# EAGLE design wisenode_v1.0 (EAGLE 6.3)
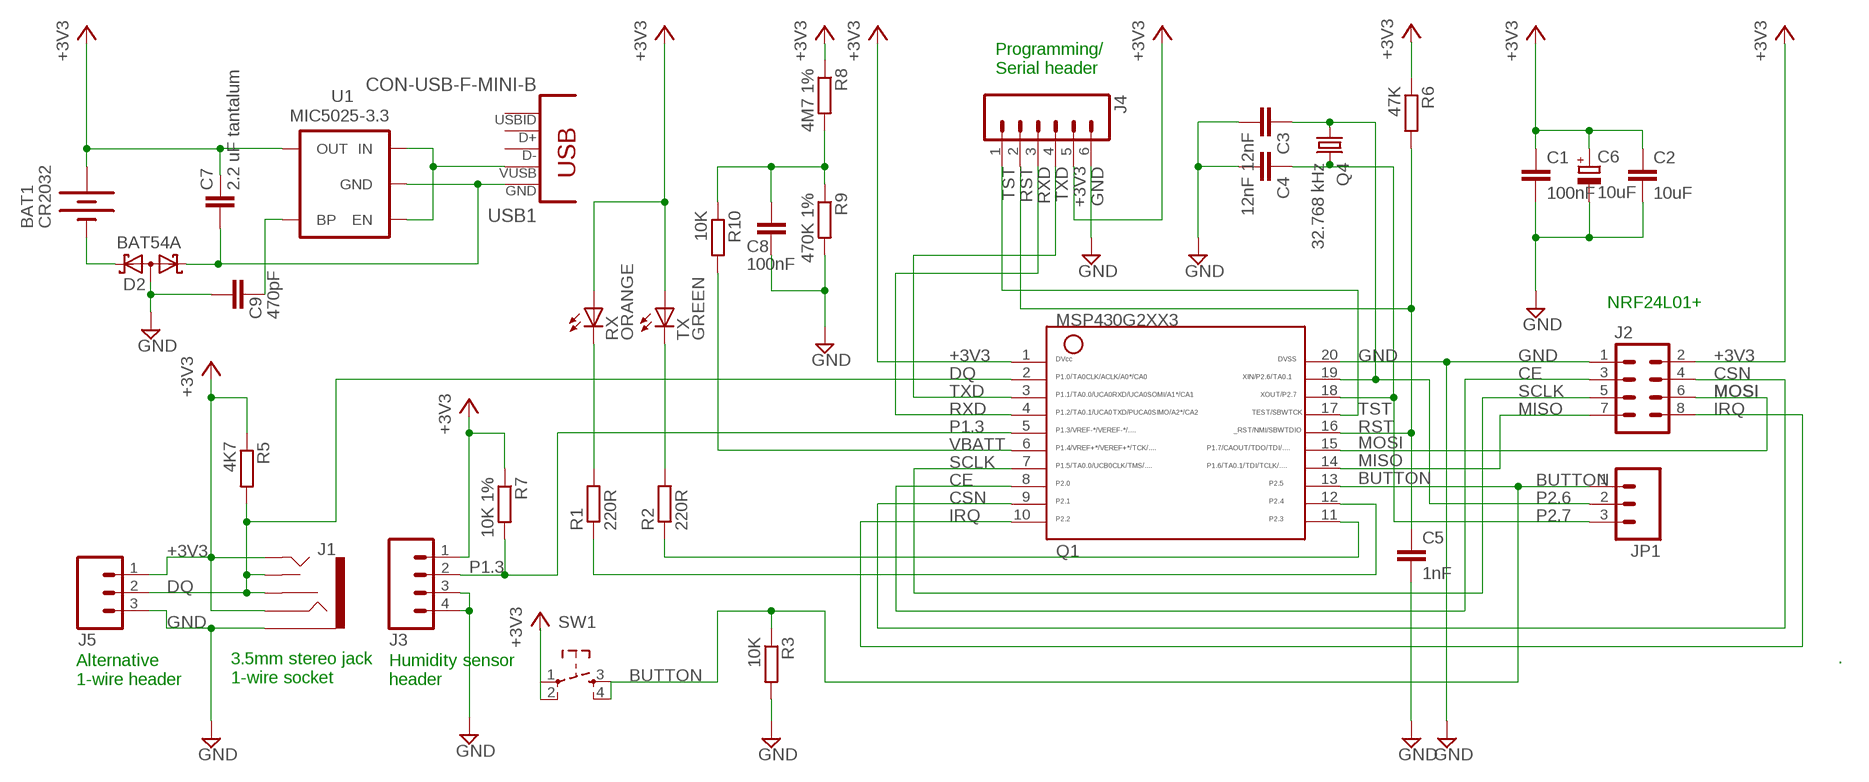
[diagram p0: schematic, sheet 1]

## Parts
BAT1  CR2032  BATTERY20PTH  [BATTCOM_20MM_PTH]
C1  100nF  C-EUC0805  [C0805]
C2  10uF  C-EUC1206  [C1206]
C3  12nF  C-EUC0805  [C0805]
C4  12nF  C-EUC0805  [C0805]
C5  1nF  C-EUC0805  [C0805]
C6  10uF  CPOL-EUE2.5-7  [E2,5-7]
C7  2.2 uF tantalum  C-EUC1206  [C1206]
C8  100nF  C-EUC0805  [C0805]
C9  470pF  C-EUC0805  [C0805]
D2  BAT54A  [SOT23]
J1  AUDIO-JACK2PTH  [AUDIO-JACK]
J2  M04X2  [2X4]
J3  M04PTH  [1X04]
J4  M06SIP  [1X06]
J5  M03PTH  [1X03]
JP1  M03PTH  [1X03]
Q1  G2XX3---PW20  [PW20]
Q4  32.768 kHz  CRYSTALTC38H  [TC38H]
R1  220R  R-EU_M0805  [M0805]
R2  220R  R-EU_M0805  [M0805]
R3  10K  R-EU_M0805  [M0805]
R5  4K7  R-EU_M0805  [M0805]
R6  47K  R-EU_M0805  [M0805]
R7  10K 1%  R-EU_M0805  [M0805]
R8  4M7 1%  R-EU_M0805  [M0805]
R9  470K 1%  R-EU_M0805  [M0805]
R10  10K  R-EU_M0805  [M0805]
RX  ORANGE  LEDCHIPLED_0805  [CHIPLED_0805]
SW1  SW_TACT_4P  [SW_TACT_SMALL]
TX  GREEN  LEDCHIPLED_0805  [CHIPLED_0805]
U1  MIC5025-3.3  V_REG_LDOSMD  [SOT23-5]
USB1  CON-USB-F-MINI-B  [CONN_USB_MINI-B]

## Nets
+3V3: BAT1.1(+) C1.1 C2.1 C6.+ C7.1 J1.RING J1.TIP J2.2 J3.1 J4.5 J5.1 Q1.1 R5.1 R6.1 R7.1 R8.1 RX.A SW1.1 SW1.2 TX.A U1.5(OUT)
BUTTON: JP1.1 Q1.13 R3.1 SW1.3 SW1.4
CE: J2.3 Q1.8
CSN: J2.4 Q1.9
DQ: J1.RSH J1.TSH J5.2 Q1.2 R5.2
GND: C1.2 C2.2 C3.2 C4.2 C5.2 C6.- C8.2 C9.1 D2.3(AA) J1.SLEEVE J2.1 J3.3 J3.4 J4.6 J5.3 Q1.20 R3.2 R9.2
IRQ: J2.8 Q1.10
MISO: J2.7 Q1.14
MOSI: J2.6 Q1.15
N$1: R2.2 TX.C
N$2: R1.2 RX.C
N$3: Q1.11 R2.1
N$5: Q1.12 R1.1
N$11: C7.2 D2.1(K1) U1.2(GND) USB1.GND
N$12: U1.1(IN) U1.3(EN) USB1.VUSB
N$13: BAT1.2(-) D2.2(K2)
N$15: C9.2 U1.4(BP)
P1.3: J3.2 Q1.5 R7.2
P2.6: C3.1 JP1.2 Q1.19 Q4.1
P2.7: C4.1 JP1.3 Q1.18 Q4.2
RST: C5.1 J4.2 Q1.16 R6.2
RXD: J4.3 Q1.4
SCLK: J2.5 Q1.7
TST: J4.1 Q1.17
TXD: J4.4 Q1.3
VBATT: Q1.6 R10.2
VBATT1: C8.1 R8.2 R9.1 R10.1
Unconnected: USB1.BODY@1(BODY) USB1.BODY@2(BODY) USB1.BODY@3(BODY) USB1.BODY@4(BODY) USB1.D+ USB1.D- USB1.ID(USBID)

## Notes on the sheet
- Programming/
  Serial header
- NRF24L01+
- .
- 3.5mm stereo jack
  1-wire socket
- Alternative
  1-wire header
- Humidity sensor 
  header

## Library data of the parts
BAT1 = SparkFun:BATTERY: Battery Holders Various common sizes : AA, AAA, 20mm coin cell and 12mm coin cell.
C1 C3-C5 C8 C9 = resistor:C-EU: CAPACITOR, European symbol
C2 C7 = rcl:C-EU: CAPACITOR, European symbol
C6 = rcl:CPOL-EU: POLARIZED CAPACITOR, European symbol
D2 = diode:BAT54A: Schottky Diodes Source: Fairchild .. BAT54.pdf
J1 = SparkFun-Connectors:AUDIO-JACK2: Stereo audio jack with bypass switches.
J2 = SparkFun:M04X2
J3 = SparkFun:M04: Header 4 Standard 4-pin 0.1" header. Use with straight break away headers (SKU : PRT-00116), right angle break away headers (PRT-00553), swiss pins (PRT-00743), machine pins (PRT-00117), and female headers (PRT-00115). Molex polarized connector foot print use with SKU : PRT-08231 with associated crimp pins and housings. 1MM SMD Version SKU: PRT-10208
J4 = SparkFun:M06: Header 6 Standard 6-pin 0.1" header. Use with straight break away headers (SKU : PRT-00116), right angle break away headers (PRT-00553), swiss pins (PRT-00743), machine pins (PRT-00117), and female headers (PRT-00115). Molex polarized connector foot print use with SKU : PRT-08094 with associated crimp pins and housings. NOTES ON THE VARIANTS LOCK and LOCK_LONGPADS... This footprint was designed to help hold the alignment of a through-hole component (i.e. 6-pin header) while soldering it into place. You may notice that each hole has been shifted either up or down by 0.005 of an inch from it's more standard position (which is a perfectly straight line). This slight alteration caused the pins (the squares in the middle) to touch the edges of the holes. Because they are alternating, it causes a "brace" to hold the component in place. 0.005 has proven to be the perfect amount of "off-center" position when using our standard breakaway headers. Although looks a little odd when you look at the bare footprint, once you have a header in there, the alteration is very hard to notice. Also, if you push a header all the way into place, it is covered up entirely on the bottom side. This idea of altering the position of holes to aid alignment will be further integrated into the Sparkfun Library for other footprints. It can help hold any component with 3 or more connection pins.
J5 JP1 = SparkFun:M03: Header 3 Standard 3-pin 0.1" header. Use with straight break away headers (SKU : PRT-00116), right angle break away headers (PRT-00553), swiss pins (PRT-00743), machine pins (PRT-00117), and female headers (PRT-00115). Molex polarized connector foot print use with SKU : PRT-08232 with associated crimp pins and housings.
Q1 = TI_MSP430_v16:G2XX3---PW20: MSP430G2XX1 TSSOP (PW) 20 Pin Package
Q4 = crystal:CRYSTAL: CRYSTAL; OC_FARNELL: unknown; OC_NEWARK: unknown
R1-R3 R5-R10 = resistor:R-EU_: RESISTOR, European symbol; RESISTANCE: 4K7
RX TX = led:LED: LED OSRAM: - CHIPLED LG R971, LG N971, LY N971, LG Q971, LY Q971, LO R971, LY R971 LH N974, LH R974 LS Q976, LO Q976, LY Q976 LO Q996 - Hyper CHIPLED LW Q18S LB Q993, LB Q99A, LB R99A - SideLED LS A670, LO A670, LY A670, LG A670, LP A670 LB A673, LV A673, LT A673, LW A673 LH A674 LY A675 LS A676, LA A676, LO A676, LY A676, LW A676 LS A679, LY A679, LG A679 - Hyper Micro SIDELED® LS Y876, LA Y876, LO Y876, LY Y876 LT Y87S - SmartLED LW L88C, LW L88S LB L89C, LB L89S, LG L890 LS L89K, LO L89K, LY L89K LS L896, LA L896, LO L896, LY L896 - TOPLED LS T670, LO T670, LY T670, LG T670, LP T670 LSG T670, LSP T670, LSY T670, LOP T670, LYG T670 LG T671, LOG T671, LSG T671 LB T673, LV T673, LT T673, LW T673 LH T674 LS T676, LA T676, LO T676, LY T676, LB T676, LH T676, LSB T676, LW T676 LB T67C, LV T67C, LT T67C, LS T67K, LO T67K, LY T67K, LW E67C LS E67B, LA E67B, LO E67B, LY E67B, LB E67C, LV E67C, LT E67C LW T67C LS T679, LY T679, LG T679 LS T770, LO T770, LY T770, LG T770, LP T770 LB T773, LV T773, LT T773, LW T773 LH T774 LS E675, LA E675, LY E675, LS T675 LS T776, LA T776, LO T776, LY T776, LB T776 LHGB T686 LT T68C, LB T68C - Hyper Mini TOPLED® LB M676 - Mini TOPLED Santana® LG M470 LS M47K, LO M47K, LY M47K Source: http://www.osram.convergy.de LUXEON: - LUMILED® LXK2-PW12-R00, LXK2-PW12-S00, LXK2-PW14-U00, LXK2-PW14-V00 LXK2-PM12-R00, LXK2-PM12-S00, LXK2-PM14-U00 LXK2-PE12-Q00, LXK2-PE12-R00, LXK2-PE12-S00, LXK2-PE14-T00, LXK2-PE14-U00 LXK2-PB12-K00, LXK2-PB12-L00, LXK2-PB12-M00, LXK2-PB14-N00, LXK2-PB14-P00, LXK2-PB14-Q00 LXK2-PR12-L00, LXK2-PR12-M00, LXK2-PR14-Q00, LXK2-PR14-R00 LXK2-PD12-Q00, LXK2-PD12-R00, LXK2-PD12-S00 LXK2-PH12-R00, LXK2-PH12-S00 LXK2-PL12-P00, LXK2-PL12-Q00, LXK2-PL12-R00 Source: www.luxeon.com KINGBRIGHT: KA-3528ASYC Source: www.kingbright.com
SW1 = dp_devices:SW_TACT_4P
U1 = SparkFun:V_REG_LDO: Voltage Regulator LDO Standard 150mA LDO voltage regulator in SOT-23 layout. Micrel part MIC5205. BP (by-pass) pin is used to lower output noise with 470pF cap.
USB1 = dp_devices:CON-USB-F: USB Female connector

## Board
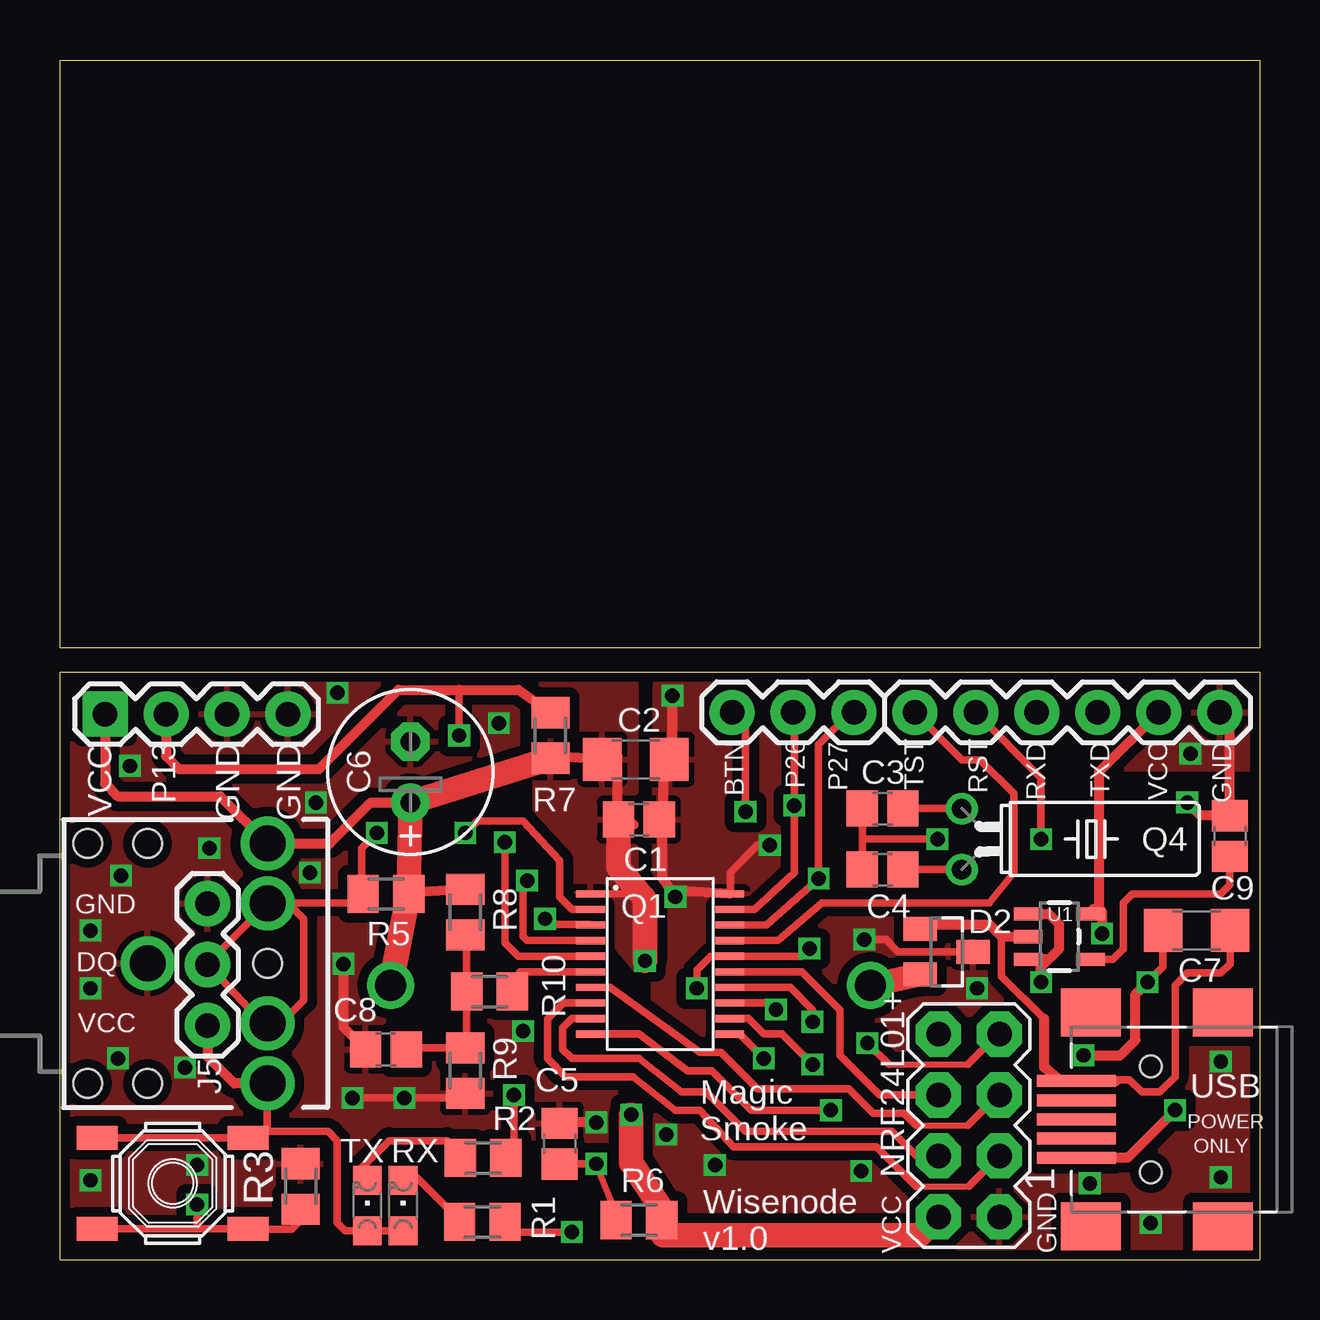
[diagram p1: board, top side]
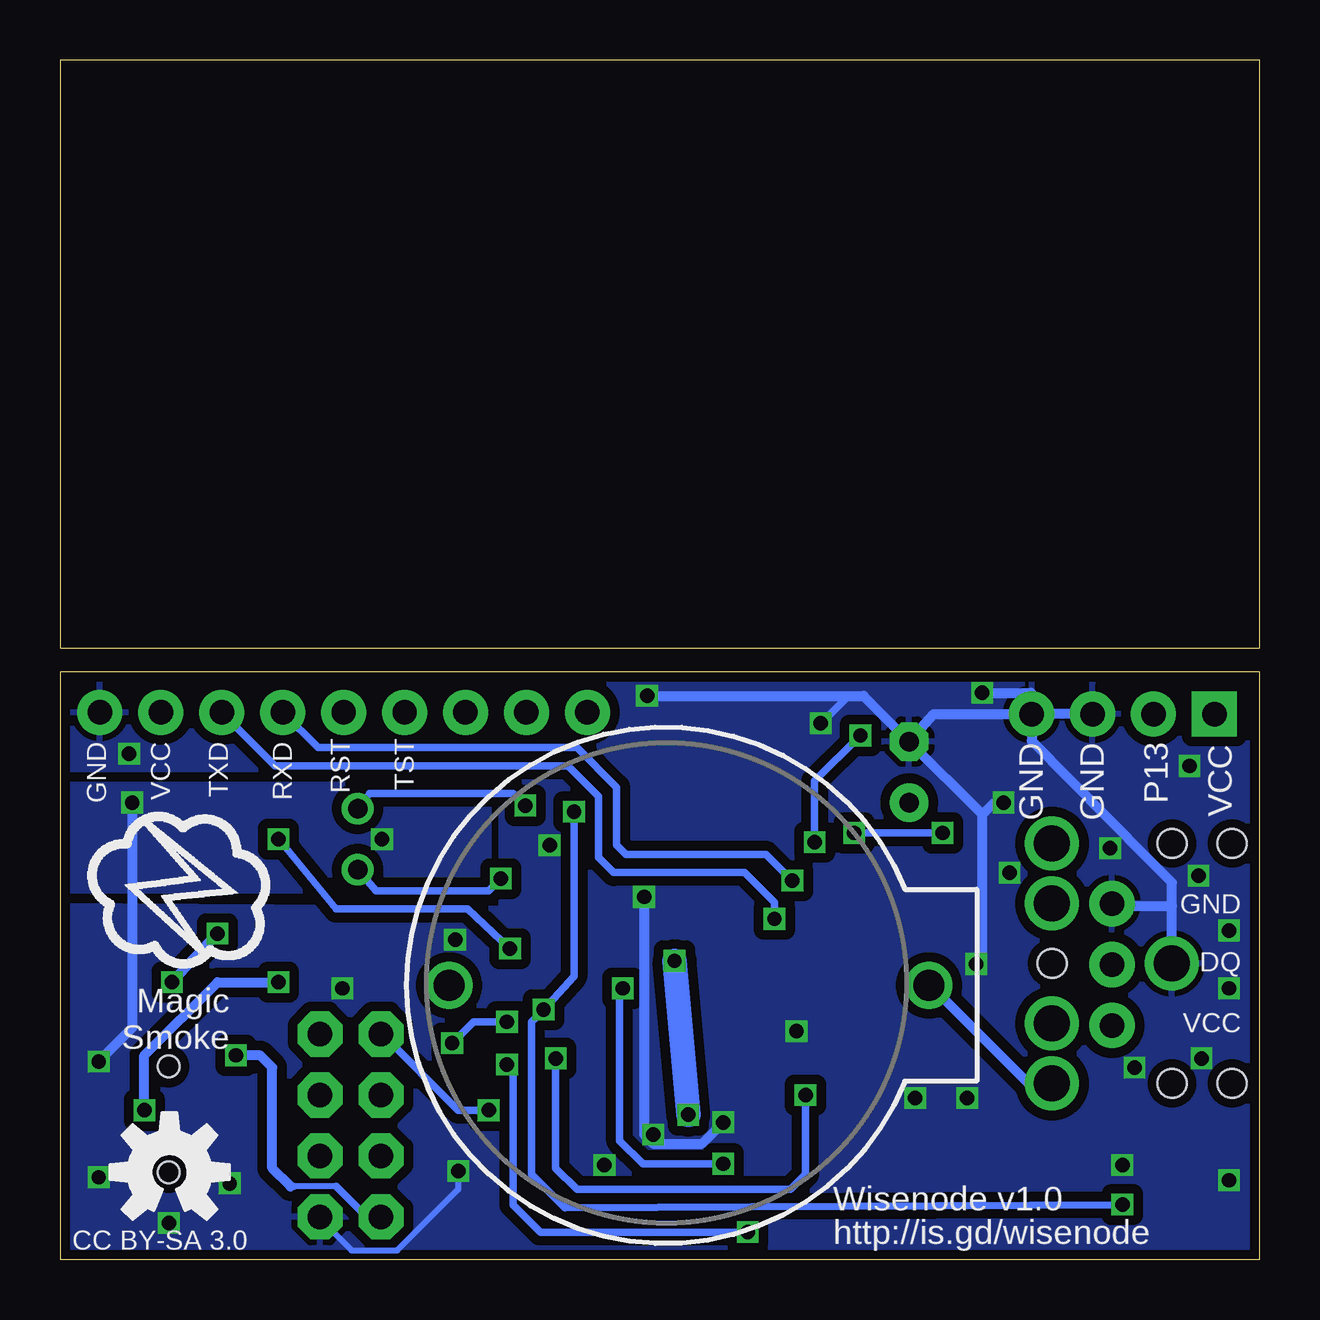
[diagram p2: board, bottom side, seen from below]

Size 50 x 50 mm. Coordinates in mm from the lower left corner, seen from the top.
Outline: 0,0 50,0 50,24.5 0,24.5 0,0
Outline: 0,25.5 0,50 50,50 50,25.5 0,25.5
Copper layers (1*16): Top 0.035mm / dielectric 1.5mm / Bottom 0.035mm
Design rules "Fusion_eagle_rule_v1.1": minimum track width 6mil, minimum drill 12mil, track to track 6mil, track to pad 6mil, pad to pad 6mil, via to via 6mil, smd to smd 0mil, copper to edge 10mil, drill to drill 10mil, minimum pad ring 10mil, minimum via ring 6mil, stop-mask expansion 2mil, vias tented up to drill 100mil, thermal gap 10mil

### Footprints (pad centres in the part's own frame; a part is rotated, then mirrored left to right if it is on the bottom)
BATTCOM_20MM_PTH = drill 1.3: 1 20,0; 2 0,0
C0805 = smd 1.3 x 1.5: 1 -0.85,0; 2 0.85,0
C1206 = smd 1.6 x 1.8: 1 -1.4,0; 2 1.4,0
E2,5-7 = drill 0.813 pad 1.6: + -1.27,0 | drill 0.813 pad 1.6 octagon: - 1.27,0
SOT23 = smd 1 x 1.4: 1 -0.95,-1.1; 2 0.95,-1.1; 3 0,1.1
AUDIO-JACK = drill 1.5 pad 2.184: RING 5,5; RSH 5,2.5; SLEEVE 0,0; TIP 5,-5; TSH 5,-2.5 | hole 1.2: 0,5; -2.5,5; -2.5,-5; 0,-5; 5,0
2X4 = drill 1.016 pad 1.88 octagon: 1 -3.81,-1.27; 2 -3.81,1.27; 3 -1.27,-1.27; 4 -1.27,1.27; 5 1.27,-1.27; 6 1.27,1.27; 7 3.81,-1.27; 8 3.81,1.27
1X04 = drill 1.016 pad 1.88 square: 1 0,0 | drill 1.016 pad 1.88: 2 2.54,0; 3 5.08,0; 4 7.62,0
1X06 = drill 1.016 pad 1.88: 1 0,0; 2 2.54,0; 3 5.08,0; 4 7.62,0; 5 10.16,0; 6 12.7,0
1X03 = drill 1.016 pad 1.88: 1 0,0; 2 2.54,0; 3 5.08,0
PW20 = smd 0.3 x 1.2: 1 -2.925,-2.9; 2 -2.275,-2.9; 3 -1.625,-2.9; 4 -0.975,-2.9; 5 -0.325,-2.9; 6 0.325,-2.9; 7 0.975,-2.9; 8 1.625,-2.9; 9 2.275,-2.9; 10 2.925,-2.9; 11 2.925,2.9; 12 2.275,2.9; 13 1.625,2.9; 14 0.975,2.9; 15 0.325,2.9; 16 -0.325,2.9; 17 -0.975,2.9; 18 -1.625,2.9; 19 -2.275,2.9; 20 -2.925,2.9
TC38H = drill 0.813: 1 -1.27,0; 2 1.27,0
M0805 = smd 1.3 x 1.6: 1 -0.95,0; 2 0.95,0
CHIPLED_0805 = smd 1.2 x 1.2: A 0,-1.05; C 0,1.05
SW_TACT_SMALL = smd 1.7 x 1: 1 -3.15,1.9; 2 3.15,1.9; 3 -3.15,-1.9; 4 3.15,-1.9
SOT23-5 = smd 0.55 x 1.2: 1 -0.95,-1.3; 2 0,-1.3; 3 0.95,-1.3; 4 0.95,1.3; 5 -0.95,1.3
CONN_USB_MINI-B = smd 2 x 2.5: BODY@1 -4.45,2.5; BODY@2 4.45,2.5; BODY@3 4.45,-3; BODY@4 -4.45,-3 | smd 0.5 x 3.3: D+ 0,3.1; D- -0.8,3.1; GND 1.6,3.1; ID 0.8,3.1; VUSB -1.6,3.1 | hole 0.9: -2.2,0; 2.2,0

### Placement (x,y rotation side)
BAT1  33.78,11.43 0 bottom
C1  24.13,18.34 0 top
C2  24,20.85 0 top
C3  34.29,18.8 180 top
C4  34.29,16.26 180 top
C5  20.83,4.83 90 top
C6  14.61,20.32 90 top
C7  47.37,13.72 0 top
C8  13.59,8.76 180 top
C9  48.77,17.65 270 top
D2  36.96,12.83 270 top
J1  3.65,12.34 0 top
J2  37.89,5.58 90 top
J3  1.88,22.73 0 top
J4  35.64,22.81 0 top
J5  6.15,9.75 90 top
JP1  28.02,22.81 0 top
Q1  25.02,12.32 270 top
Q4  37.59,17.53 270 top
R1  17.61,1.57 180 top
R2  17.64,4.24 180 top
R3  10.03,3.05 90 top
R5  13.59,15.24 180 top
R6  24.13,1.65 180 top
R7  20.45,21.84 90 top
R8  16.89,14.48 270 top
R9  16.89,7.87 270 top
R10  17.91,11.18 0 top
RX  14.3,2.25 0 top
SW1  4.7,3.17 0 top
TX  12.81,2.25 0 top
U1  41.66,13.46 270 top
U$1  [OSHW-LOGO-M]  45.43,3.64 0 bottom
USB1  45.47,5.84 90 top

### Tracks (layer width: path | path; a pad name or v marks a point on that pad's centre or on a via)
+3V3  (via drill 0.6)
  Top 0.305: Q1.1 24.17,15.24 24.28,15.13 | 43.43,14.48 43.02,14.48 U1.5 | C7.1 45.97,12.19 v45.34,11.56 | J1.TIP 8.64,7.33 8.64,5.41 8.51,5.28 8.06,5.28 SW1.2 | SW1.2 SW1.1 | RX.A 12.78,1.21 TX.A 11.88,1.2 11.56,1.52 11.56,4.95 11.18,5.33 8.11,5.33 SW1.2 | R6.1 25.33,1.85 23.83,4.03
  Top 0.406: J1.TIP 7.26,7.34 6.15,8.46 J5.1 | C1.1 23.91,18.12 23.24,18.8 23.24,20.97 C2.1 20.66,20.98 R7.1 | 14.61,15.18 R5.1 14.73,15.3 R8.1 | C6.+ 12.95,19.05 11.24,17.34 J1.RING 6.69,19.3 2.41,19.3 1.88,19.84 J3.1 | J4.5 43.31,20.32 43.31,14.76 U1.5 43.05,14.51 43.05,14.61 | v42.67,8.51 44.2,8.51 44.83,9.14 44.83,11.05 v45.34,11.56 | 43.43,14.48 v43.43,13.59
  Top 1.016: v24.38,12.45 24.38,14.99 24.28,15.13 23.28,16.34 C1.1 | BAT1.1 R5.1 C6.+ R7.1 | J2.2 36.57,1.77 35.81,1.02 25.14,1.01 25.13,2 23.83,4.03 23.81,4.03 v23.81,6.04
  Bottom 0.152: 13.97,11.43 BAT1.1
  Bottom 0.254: 38.48,3.05 40.26,3.05
  Bottom 0.305: 38.48,3.05 37.21,1.78 J2.2 | 40.26,3.05 40.39,3.05
  Bottom 0.406: 40.39,3.05 41.15,3.81 41.15,8 41.66,8.51 v42.67,8.51 | v43.43,13.59 v45.34,11.56 | BAT1.1 13.72,11.43 9.65,7.37 8.68,7.37 J1.TIP
  Bottom 1.016: v23.81,6.04 v24.38,12.45
  pour Top (isolate 0.406): 24,12.06 24,25.75 19.81,25.75 19.81,17.14
BUTTON  (via drill 0.6)
  Top 0.305: JP1.1 27.99,22.81 28.57,22.1 v28.57,18.67 | Q1.13 29.62,10.69 v29.84,10.41 | SW1.4 7.24,1.27 | 7.24,1.27 5.71,1.27 | 5.71,1.27 SW1.3 | R3.1 10.23,1.84 9.65,1.27 7.24,1.27 | v5.71,2.29 5.71,1.27
  Bottom 0.305: v28.57,18.67 28.57,11.81 v29.84,10.41 30.35,9.91 30.35,3.56 28.96,2.16 v5.71,2.29
CE
  Top 0.254: 35.69,3.05 37.9,3.05
  Top 0.305: Q1.8 20.98,10.69 20.32,10.03 20.32,8.38 21.08,7.62 23.88,7.62 25.65,6.22 26.67,6.22 28.07,4.7 34.04,4.7 35.69,3.05 | 37.9,3.05 J2.3
CSN
  Top 0.305: Q1.9 21.35,10.04 20.95,9.65 20.95,8.76 21.34,8.38 24.13,8.38 25.91,6.99 26.92,6.99 28.57,5.33 34.67,5.33 35.69,4.32 | J2.4 35.69,4.32 | 36.58,4.32 35.69,4.32
DQ  (via drill 0.6)
  Top 0.305: 9.27,14.84 J1.RSH 6.1,12.29 J5.2 8.45,9.84 J1.TSH | 9.27,14.84 9.53,14.84 10.16,14.21 10.16,10.79 9.21,9.84 | 9.27,14.84 9.29,14.86 13.08,14.86 12.95,14.99 12.95,15.24 13.02,15.17 R5.2 13.08,14.99 12.57,15.49 12.57,17.14 v13.21,17.78 | Q1.2 21.35,14.59 20.83,15.11 20.83,16.64 19.3,18.29 17.4,18.29 v16.89,17.78
  Bottom 0.305: v13.21,17.78 v16.89,17.78
GND  (via drill 0.6)
  Top 0.152: 33.02,16.51 C4.2 | 33.02,19.05 C3.2
  Top 0.254: D2.3 38.35,12.95
  Top 0.305: v12.19,6.73 16.32,6.73 R9.2 | D2.3 34.92,12.83 34.42,13.34 v33.53,13.34 | 33.44,17.44 C3.2 | 33.44,17.44 C4.2 33.27,16.26 | 33.44,17.44 33.53,17.53 v36.58,17.53 | 27.94,15.24 27.94,16.13 29.08,17.27 v29.59,17.27
  Top 0.406: 25.28,20.82 25.53,21.08 v25.53,23.5 | C2.2 25.28,20.82 | 25.28,20.82 25.15,20.82 25.15,18.16 25.11,18.25 C1.2 25.09,18.34 25.09,15.93 v25.65,15.11 25.79,15.37 Q1.20 | 12.61,8.64 C8.2 11.81,9.69 v11.81,12.32 | J4.6 48.77,22.38 C9.1 47.54,18.5 v46.99,19.05 | 20.87,5.68 C5.2 20.87,5.71 v22.35,5.71
  Bottom 0.254: 39.16,1.7 39.24,1.78 | J2.1 39.16,1.7 | 39.16,1.7 37.85,0.38 35.94,0.38 33.4,2.92 v33.4,3.68
  Bottom 0.305: 16.51,23.5 17.14,23.5 v18.29,22.35
  Bottom 0.406: J3.4 9.5,21.61 4.7,16.76 3.65,15.71 3.65,14.73 | v25.53,23.5 16.51,23.5 C6.- | J3.3 J3.4 | 11.56,18.54 C6.- | v10.67,19.05 11.05,19.05 11.56,18.54 | v25.65,15.11 25.65,5.21 25.27,4.83 23.24,4.83 v22.35,5.71 | C6.- 13.59,22.73 9.53,22.73 | 9.53,22.73 J3.4 | v11.81,12.32 11.56,12.57 11.56,18.54 | v11.56,23.62 9.53,23.62 9.53,22.73 | J1.SLEEVE 3.65,14.73 | J5.3 6.04,14.73 3.65,14.73 | v46.99,19.05 46.99,9.65 v48.39,8.26
  other vias: 2.92,20.57 1.27,13.72 25.27,5.21 2.54,16 2.41,8.38 1.27,11.3 6.22,17.14 10.41,16.13 48.39,3.43 45.47,1.52 5.71,3.94 47.12,21.08 38.23,11.3 42.93,3.17 5.21,8 27.3,3.94 1.27,3.3 14.35,6.73 19.3,9.53
  pour Top (isolate 0.406): 24.84,25.75 51.05,25.75 51.05,20.45 31.62,20.45 31.62,14.73 51.18,14.73 51.13,-1 -1,-1 -1.13,25.75 19.05,25.75 19.05,16.77 24.77,10.04
  pour Bottom (isolate 0.406): -0.5,25.13 50.5,25.13 50.42,20.45 31.62,20.45 31.62,14.61 50.55,14.73 50.5,-0.5 -0.5,-0.5
  pour Bottom (isolate 0.406): 50.55,19.81 32.13,19.81 32.13,15.37 50.55,15.37
IRQ  (via drill 0.6)
  Top 0.305: v32.13,6.22 28.83,6.22 27.18,7.87 26.16,7.87 24.13,9.4 Q1.10
  Bottom 0.305: v32.13,6.22 33.4,6.22 36.58,9.4 J2.8
MISO  (via drill 0.6)
  Top 0.254: 34.54,8.13 37.85,8.13
  Top 0.305: J2.7 39.12,9.39 37.85,8.13 | v31.37,9.91 31.37,10.41 30.44,11.34 Q1.14 | v33.66,9.02 34.54,8.13
  Bottom 0.305: v31.37,9.91 32.77,9.91 v33.66,9.02
MOSI
  Top 0.305: Q1.15 30.93,11.99 32.51,10.41 32.51,8.51 34.16,6.86 J2.6
N$1
  Top 0.305: TX.C 12.56,3.79 13.72,4.95 16.13,4.95 16.26,4.83
  Top 0.406: R2.2 16.26,4.24 16.26,4.83
N$2
  Top 0.305: R1.2 16.66,1.63 14.86,3.43 14.43,3.43 RX.C
N$3  (via drill 0.6)
  Top 0.305: Q1.11 28.32,9.4 v29.34,8.38 | v18.92,6.86 18.92,4.58 R2.1
  Bottom 0.305: v29.34,8.38 29.34,3.81 28.45,2.92 19.56,2.92 18.92,3.56 v18.92,6.86
N$5  (via drill 0.6)
  Top 0.305: Q1.12 28.69,10.04 29.34,9.4 30.1,9.4 v31.37,8.13 | v21.34,1.14 18.76,1.14 R1.1
  Bottom 0.305: v31.37,8.13 31.11,7.87 31.11,2.29 29.97,1.14 v21.34,1.14
N$11
  Top 0.305: D2.1 36.3,13.97 | 41.02,10.03 39.24,11.81 39.24,13.46 | C7.2 48.77,12.32 48.39,11.94 46.99,11.94 46.48,11.43 46.48,7.62 45.85,6.99 45.09,6.99 44.58,7.49 44.07,7.49 44.02,7.44
  Top 0.406: 36.3,13.97 38.73,13.97 39.24,13.46 U1.2 | 41.02,10.03 41.02,8 41.71,7.44 USB1.GND 44.02,7.44
N$12  (via drill 0.6)
  Top 0.406: U1.1 41.21,14.41 41.66,13.97 41.66,12.95 40.89,12.19 v40.89,11.56 40.89,12.51 | 40.89,12.51 U1.3 | v46.48,6.22 44.5,4.24 USB1.VUSB | 41.21,12.51 40.89,12.51
  Bottom 0.406: v40.89,11.56 43.43,11.56 46.48,8.51 v46.48,6.22
N$13
  Top 1.016: D2.2 BAT1.2
N$15
  Top 0.305: U1.4 43.88,12.51 44.32,12.95 44.32,14.86 44.7,15.24 48.39,15.24 48.77,15.62 C9.2
P1.3  (via drill 0.6)
  Top 0.305: Q1.5 19.11,12.64 18.54,13.21 v18.54,17.4 | v16.64,21.84 16.64,23.75
  Top 0.406: R7.2 19.11,23.75 16.64,23.75 14.1,23.75 10.79,20.45 4.95,20.45 4.42,20.98 J3.2
  Bottom 0.305: v16.64,21.84 18.54,19.94 v18.54,17.4
P2.6  (via drill 0.6)
  Top 0.305: Q1.19 28.95,14.59 30.61,16.13 v30.61,18.92 30.61,22.61 JP1.2 | Q4.1 C3.1
  Bottom 0.305: v30.61,18.92 31.11,19.43 37.08,19.43 Q4.1
P2.7  (via drill 0.6)
  Top 0.305: Q4.2 C4.1 | Q1.18 29.44,13.94 v31.62,15.88 31.62,21.46 32.97,22.81 JP1.3
  Bottom 0.305: v31.62,15.88 32.13,15.37 36.83,15.37 Q4.2
RST  (via drill 0.6)
  Top 0.254: R6.2 23.05,2.27 v22.35,3.99
  Top 0.305: J4.2 40.89,20.07 v40.89,17.53 | v31.24,12.95 30.93,12.64 Q1.16 27.12,12.64 26.54,12.06 v26.54,11.3 | v22.35,3.99 21.09,3.99 C5.1
  Bottom 0.305: v40.89,17.53 38.48,14.61 33.02,14.61 v31.24,12.95 | v26.54,11.3 26.67,11.05 26.67,4.95 25.7,3.99 v22.35,3.99
RXD  (via drill 0.6)
  Top 0.305: Q1.4 19.47,13.29 19.3,13.46 19.3,15.62 v19.47,15.79
  Bottom 0.305: J4.3 39.24,21.34 28.45,21.34 26.8,19.68 26.8,17.27 26.42,16.89 20.57,16.89 v19.47,15.79
SCLK
  Top 0.254: 35.69,5.59 37.85,5.59
  Top 0.305: J2.5 39.11,6.86 37.85,5.59 | Q1.7 22.95,11.34 22.99,11.3 26.67,8.64 27.56,8.64 29.08,7.11 32.89,7.11 33.91,6.1 35.18,6.1 35.69,5.59
TST
  Top 0.305: J4.1 37.59,20.83 38.35,20.83 39.75,19.43 39.75,16.13 38.73,14.86 31.75,14.86 29.93,13.29 Q1.17
TXD  (via drill 0.6)
  Top 0.305: v20.22,14.2 20.45,13.97 22.09,13.97 Q1.3
  Bottom 0.305: J4.4 41.02,20.57 28.83,20.57 27.56,19.3 27.56,16.76 26.92,16.13 21.46,16.13 20.22,14.88 v20.22,14.2
VBATT
  Top 0.305: Q1.6 19.17,11.99 R10.2
VBATT1
  Top 0.305: R8.2 16.96,13.46 R10.1 16.96,8.89 R9.1 14.5,8.82 C8.1

### Text on the board
tPlace: USB | Magic / Smoke | POWER | ONLY | Wisenode / v1.0
bPlace: Magic / Smoke | Wisenode v1.0 | http://is.gd/wisenode | CC BY-SA 3.0
tNames: P13 | GND | GND | BTN | P26 | P27 | TST | RST | RXD | TXD | VCC | GND | VCC | GND | DQ | NRF24L01+ | VCC | VCC | GND
bNames: P13 | GND | GND | TST | RST | RXD | TXD | VCC | GND | VCC | GND | DQ | VCC